# EAGLE design stm32-d40plus (EAGLE 6.4)

## Sheet 1 of 2
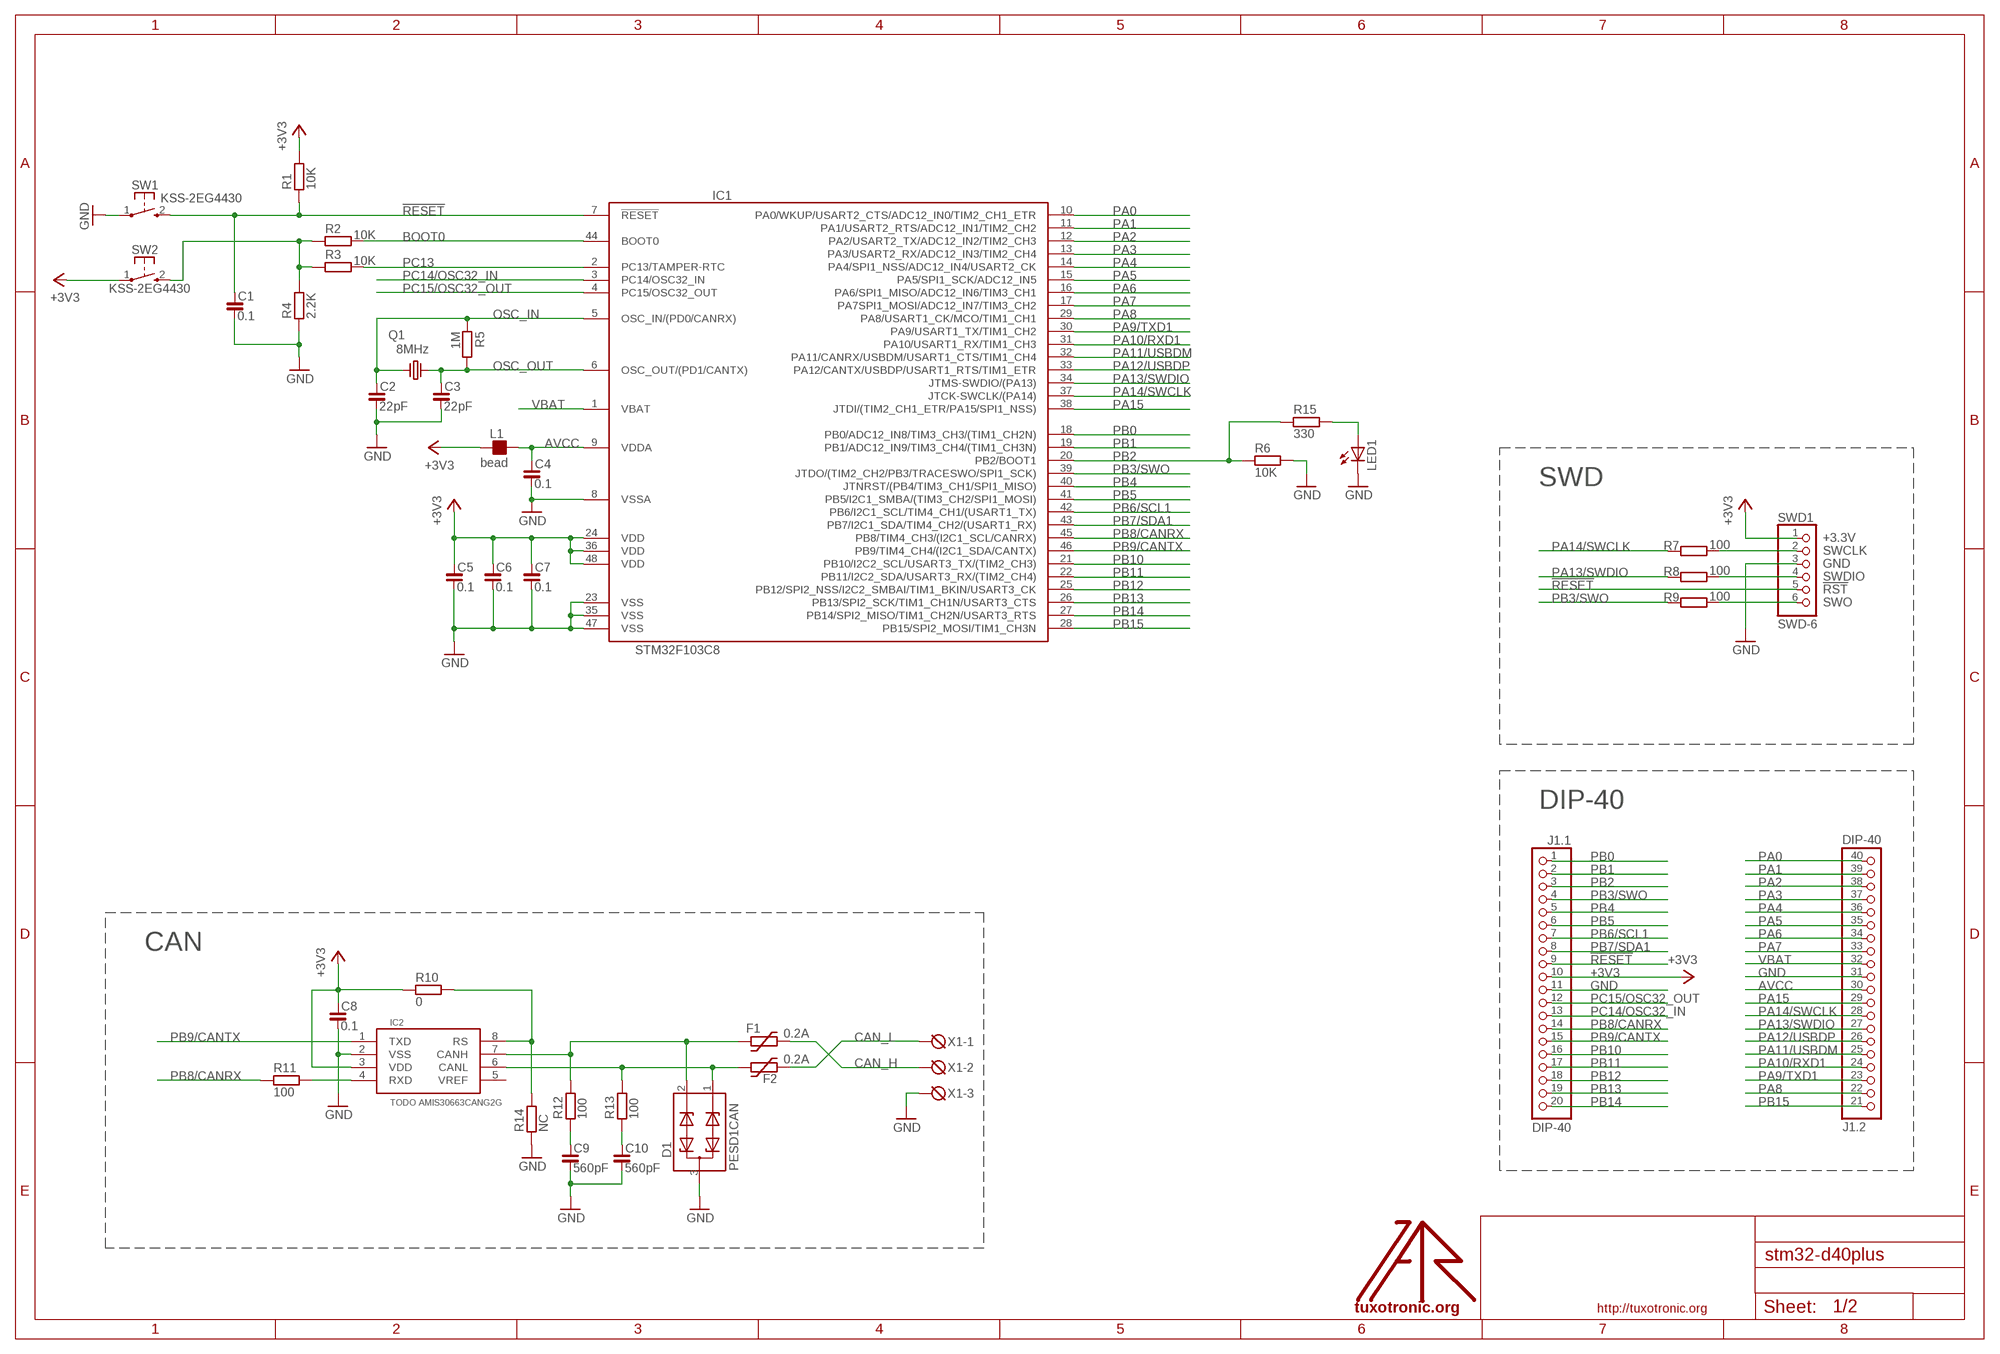
[diagram p0: schematic, sheet 1]

### Parts
C1  0.1  C_0603  [C0603]
C2  22pF  C_0603  [C0603]
C3  22pF  C_0603  [C0603]
C4  0.1  C_0603  [C0603]
C5  0.1  C_0603  [C0603]
C6  0.1  C_0603  [C0603]
C7  0.1  C_0603  [C0603]
C8  0.1  C_0603  [C0603]
C9  560pF  C_0603  [C0603]
C10  560pF  C_0603  [C0603]
D1  PESD1CAN  [SOT23]
F1  0.2A  1206L  [1206L]
F2  0.2A  1206L  [1206L]
IC1  STM32F103C8  [LQFP48]
IC2  TODO AMIS30663CANG2G  SN65HVD230  [SO08]
J1  DIP-40  [DIP-40]
L1  bead  FB_0603  [L0603]
LED1  LEDCHIPLED_0603  [CHIPLED_0603]
Q1  8MHz  CRYSTAL-HC49S  [HC49/S]
R1  10K  R_0603  [R0603]
R2  10K  R_0603  [R0603]
R3  10K  R_0603  [R0603]
R4  2.2K  R_0603  [R0603]
R5  1M  R_0603  [R0603]
R6  10K  R_0603  [R0603]
R7  100  R_0603  [R0603]
R8  100  R_0603  [R0603]
R9  100  R_0603  [R0603]
R10  0  R_0603  [R0603]
R11  100  R_0603  [R0603]
R12  100  R_0603  [R0603]
R13  100  R_0603  [R0603]
R14  NC  R_0603  [R0603]
R15  330  R_0603  [R0603]
SW1  KSS-2EG4430  [KSS-2EG4430]
SW2  KSS-2EG4430  [KSS-2EG4430]
SWD1  SWD-6  [JTAG6PIN]
U$  LOGO  [TT_LOGO]
X1  DG3XX-03-3.5  [DG350-3.5-03P]

### Nets
!RESET: C1.1 IC1.7(!RESET) J1.9 R1.1 SW1.2(S) SWD1.5
+3V3: C5.1 C6.1 C7.1 C8.1 IC1.24(VDD) IC1.36(VDD) IC1.48(VDD) IC2.3(VDD) J1.10 L1.1 R1.2 R10.1 SW2.1(P) SWD1.1
AVCC: C4.1 IC1.9(VDDA) J1.30 L1.2
BOOT0: IC1.44(BOOT0) R2.2
CAN_CTRL: IC2.8(RS) R10.2 R14.2
CAN_H: F1.P$2 X1.2
CAN_L: F2.P$2 X1.1
GND: C1.2 C2.2 C3.2 C4.2 C5.2 C6.2 C7.2 C8.2 C9.2 C10.2 D1.3 IC1.8(VSSA) IC1.23(VSS) IC1.35(VSS) IC1.47(VSS) IC2.2(VSS) J1.11 J1.31 LED1.C R4.1 R6.2 R14.1 SW1.1(P) SWD1.3 X1.3
N$1: R2.1 R3.1 R4.2 SW2.2(S)
N$2: R7.2 SWD1.2
N$3: R8.2 SWD1.4
N$4: R9.2 SWD1.6
N$5: LED1.A R15.2
N$7: IC2.4(RXD) R11.2
N$51: D1.2 F1.P$1 IC2.7(CANH) R12.2
N$52: D1.1 F2.P$1 IC2.6(CANL) R13.2
N$54: C10.1 R13.1
N$55: C9.1 R12.1
OSC_IN: C2.1 IC1.5(OSC_IN/(PD0/CANRX)) Q1.1 R5.1
OSC_OUT: C3.1 IC1.6(OSC_OUT/(PD1/CANTX)) Q1.2 R5.2
PA0: IC1.10(PA0/WKUP/USART2_CTS/ADC12_IN0/TIM2_CH1_ETR) J1.40
PA1: IC1.11(PA1/USART2_RTS/ADC12_IN1/TIM2_CH2) J1.39
PA2: IC1.12(PA2/USART2_TX/ADC12_IN2/TIM2_CH3) J1.38
PA3: IC1.13(PA3/USART2_RX/ADC12_IN3/TIM2_CH4) J1.37
PA4: IC1.14(PA4/SPI1_NSS/ADC12_IN4/USART2_CK) J1.36
PA5: IC1.15(PA5/SPI1_SCK/ADC12_IN5) J1.35
PA6: IC1.16(PA6/SPI1_MISO/ADC12_IN6/TIM3_CH1) J1.34
PA7: IC1.17(PA7SPI1_MOSI/ADC12_IN7/TIM3_CH2) J1.33
PA8: IC1.29(PA8/USART1_CK/MCO/TIM1_CH1) J1.22
PA9/TXD1: IC1.30(PA9/USART1_TX/TIM1_CH2) J1.23
PA10/RXD1: IC1.31(PA10/USART1_RX/TIM1_CH3) J1.24
PA11/USBDM: IC1.32(PA11/CANRX/USBDM/USART1_CTS/TIM1_CH4) J1.25
PA12/USBDP: IC1.33(PA12/CANTX/USBDP/USART1_RTS/TIM1_ETR) J1.26
PA13/SWDIO: IC1.34(JTMS-SWDIO/(PA13)) J1.27 R8.1
PA14/SWCLK: IC1.37(JTCK-SWCLK/(PA14)) J1.28 R7.1
PA15: IC1.38(JTDI/(TIM2_CH1_ETR/PA15/SPI1_NSS)) J1.29
PB0: IC1.18(PB0/ADC12_IN8/TIM3_CH3/(TIM1_CH2N)) J1.1
PB1: IC1.19(PB1/ADC12_IN9/TIM3_CH4/(TIM1_CH3N)) J1.2
PB2: IC1.20(PB2/BOOT1) J1.3 R6.1 R15.1
PB3/SWO: IC1.39(JTDO/(TIM2_CH2/PB3/TRACESWO/SPI1_SCK)) J1.4 R9.1
PB4: IC1.40(JTNRST/(PB4/TIM3_CH1/SPI1_MISO)) J1.5
PB5: IC1.41(PB5/I2C1_SMBA/(TIM3_CH2/SPI1_MOSI)) J1.6
PB6/SCL1: IC1.42(PB6/I2C1_SCL/TIM4_CH1/(USART1_TX)) J1.7
PB7/SDA1: IC1.43(PB7/I2C1_SDA/TIM4_CH2/(USART1_RX)) J1.8
PB8/CANRX: IC1.45(PB8/TIM4_CH3/(I2C1_SCL/CANRX)) J1.14 R11.1
PB9/CANTX: IC1.46(PB9/TIM4_CH4/(I2C1_SDA/CANTX)) IC2.1(TXD) J1.15
PB10: IC1.21(PB10/I2C2_SCL/USART3_TX/(TIM2_CH3)) J1.16
PB11: IC1.22(PB11/I2C2_SDA/USART3_RX/(TIM2_CH4)) J1.17
PB12: IC1.25(PB12/SPI2_NSS/I2C2_SMBAI/TIM1_BKIN/USART3_CK) J1.18
PB13: IC1.26(PB13/SPI2_SCK/TIM1_CH1N/USART3_CTS) J1.19
PB14: IC1.27(PB14/SPI2_MISO/TIM1_CH2N/USART3_RTS) J1.20
PB15: IC1.28(PB15/SPI2_MOSI/TIM1_CH3N) J1.21
PC13: IC1.2(PC13/TAMPER-RTC) R3.2
PC14/OSC32_IN: IC1.3(PC14/OSC32_IN) J1.13
PC15/OSC32_OUT: IC1.4(PC15/OSC32_OUT) J1.12
VBAT: IC1.1(VBAT) J1.32
Unconnected: IC2.5(VREF)

### Notes on the sheet
- SWD
- DIP-40
- CAN

## Sheet 2 of 2
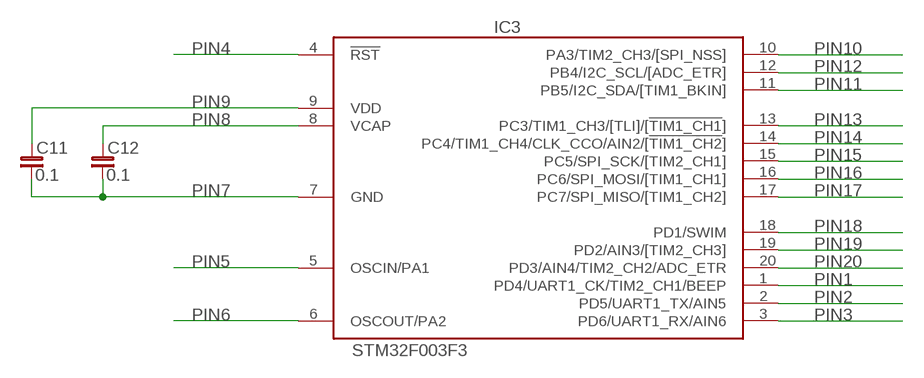
[diagram p1: schematic, sheet 2]

### Parts
C11  0.1  C_0805  [C0805]
C12  0.1  C_0805  [C0805]
IC3  STM32F003F3  [TSSOP20]

### Nets
PIN1: IC3.1(PD4/UART1_CK/TIM2_CH1/BEEP)
PIN2: IC3.2(PD5/UART1_TX/AIN5)
PIN3: IC3.3(PD6/UART1_RX/AIN6)
PIN4: IC3.4(!RST)
PIN5: IC3.5(OSCIN/PA1)
PIN6: IC3.6(OSCOUT/PA2)
PIN7: C11.2 C12.2 IC3.7(GND)
PIN8: C12.1 IC3.8(VCAP)
PIN9: C11.1 IC3.9(VDD)
PIN10: IC3.10(PA3/TIM2_CH3/[SPI_NSS])
PIN11: IC3.11(PB5/I2C_SDA/[TIM1_BKIN])
PIN12: IC3.12(PB4/I2C_SCL/[ADC_ETR])
PIN13: IC3.13(PC3/TIM1_CH3/[TLI]/[!TIM1_CH1!])
PIN14: IC3.14(PC4/TIM1_CH4/CLK_CCO/AIN2/[!TIM1_CH2!])
PIN15: IC3.15(PC5/SPI_SCK/[TIM2_CH1])
PIN16: IC3.16(PC6/SPI_MOSI/[TIM1_CH1])
PIN17: IC3.17(PC7/SPI_MISO/[TIM1_CH2])
PIN18: IC3.18(PD1/SWIM)
PIN19: IC3.19(PD2/AIN3/[TIM2_CH3])
PIN20: IC3.20(PD3/AIN4/TIM2_CH2/ADC_ETR)

## Library data of the parts
C1-C12 = rc-master-smd:C_: NON-POLARIZED CAP
D1 = protect:PESD1CAN: Features Due to the integrated diode structure only one small SOT23 package is needed to protect two CAN bus lines Max. peak pulse power: PPP = 200 W at tp = 8/20 ?s Low clamping voltage: VCL = 40 V at IPP = 1 A Ultra low leakage current: IRM < 1 nA ESD protection up to 23 kV IEC 61000-4-2, level 4 (ESD) IEC 61000-4-5 (surge); IPP = 3 A at tp = 8/20 ?s Small SMD plastic package Applications CAN bus protection Automotive applications
F1 F2 = ptc-littlefuse:1206L
IC1 = stm32:STM32F103C
IC2 = interfaces:SN65HVD230: CAN PHY driver
IC3 = stm8:STM32F003: Value line, 16 MHz STM8S 8-bit MCU, 8 Kbytes Flash, 128 bytes data EEPROM, 10-bit ADC, 3 timers, UART, SPI, I2C
J1 = stamp:DIP-40
L1 = rc-master-smd:FB_: FERRITE BEAD
LED1 = led:LED: LED OSRAM: - CHIPLED LG R971, LG N971, LY N971, LG Q971, LY Q971, LO R971, LY R971 LH N974, LH R974 LS Q976, LO Q976, LY Q976 LO Q996 - Hyper CHIPLED LW Q18S LB Q993, LB Q99A, LB R99A - SideLED LS A670, LO A670, LY A670, LG A670, LP A670 LB A673, LV A673, LT A673, LW A673 LH A674 LY A675 LS A676, LA A676, LO A676, LY A676, LW A676 LS A679, LY A679, LG A679 - Hyper Micro SIDELED® LS Y876, LA Y876, LO Y876, LY Y876 LT Y87S - SmartLED LW L88C, LW L88S LB L89C, LB L89S, LG L890 LS L89K, LO L89K, LY L89K LS L896, LA L896, LO L896, LY L896 - TOPLED LS T670, LO T670, LY T670, LG T670, LP T670 LSG T670, LSP T670, LSY T670, LOP T670, LYG T670 LG T671, LOG T671, LSG T671 LB T673, LV T673, LT T673, LW T673 LH T674 LS T676, LA T676, LO T676, LY T676, LB T676, LH T676, LSB T676, LW T676 LB T67C, LV T67C, LT T67C, LS T67K, LO T67K, LY T67K, LW E67C LS E67B, LA E67B, LO E67B, LY E67B, LB E67C, LV E67C, LT E67C LW T67C LS T679, LY T679, LG T679 LS T770, LO T770, LY T770, LG T770, LP T770 LB T773, LV T773, LT T773, LW T773 LH T774 LS E675, LA E675, LY E675, LS T675 LS T776, LA T776, LO T776, LY T776, LB T776 LHGB T686 LT T68C, LB T68C - Hyper Mini TOPLED® LB M676 - Mini TOPLED Santana® LG M470 LS M47K, LO M47K, LY M47K Source: http://www.osram.convergy.de - LUMILED® LXK2-PW12-R00, LXK2-PW12-S00, LXK2-PW14-U00, LXK2-PW14-V00 LXK2-PM12-R00, LXK2-PM12-S00, LXK2-PM14-U00 LXK2-PE12-Q00, LXK2-PE12-R00, LXK2-PE12-S00, LXK2-PE14-T00, LXK2-PE14-U00 LXK2-PB12-K00, LXK2-PB12-L00, LXK2-PB12-M00, LXK2-PB14-N00, LXK2-PB14-P00, LXK2-PB14-Q00 LXK2-PR12-L00, LXK2-PR12-M00, LXK2-PR14-Q00, LXK2-PR14-R00 LXK2-PD12-Q00, LXK2-PD12-R00, LXK2-PD12-S00 LXK2-PH12-R00, LXK2-PH12-S00 LXK2-PL12-P00, LXK2-PL12-Q00, LXK2-PL12-R00 Source: www.luxeon.com
Q1 = discrete:CRYSTAL-: CRYSTAL
R1-R15 = rc-master-smd:R_: RESISTOR
SW1 SW2 = buttons:KSS-2EG4430: Size: 3x6mm Height: 5mm from PCB Rating: DC12v 50mA Travel: 0.25±0.10mm Operating Force: 180±50gf Return Force: 60gf min Contact resistance: 100m? max Insulation resistance: 100M? min Operating life?50,000 cycles
SWD1 = jtag:SWD-6: STM32Fx Discovery
U$ = logo:LOGO
X1 = degson:DG3XX-03: DG350-3.5-03P DG306-5.0-03P

## Board
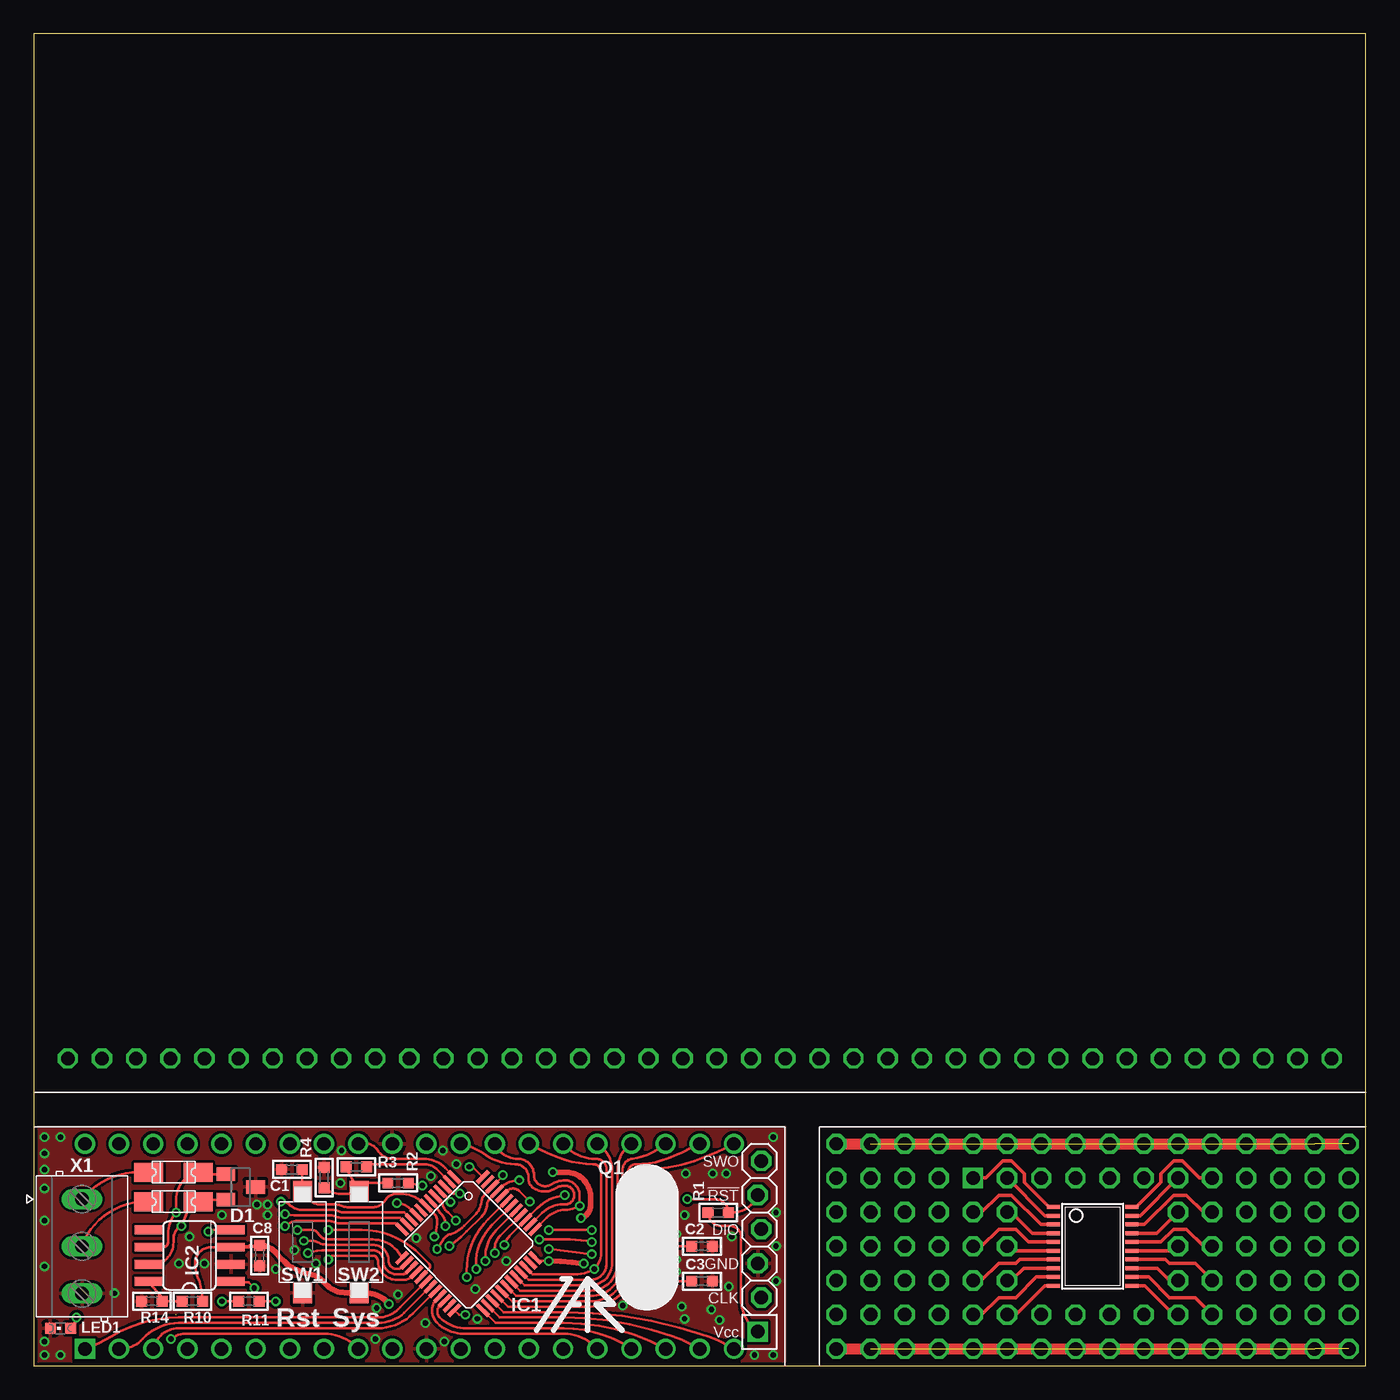
[diagram p2: board, top side]
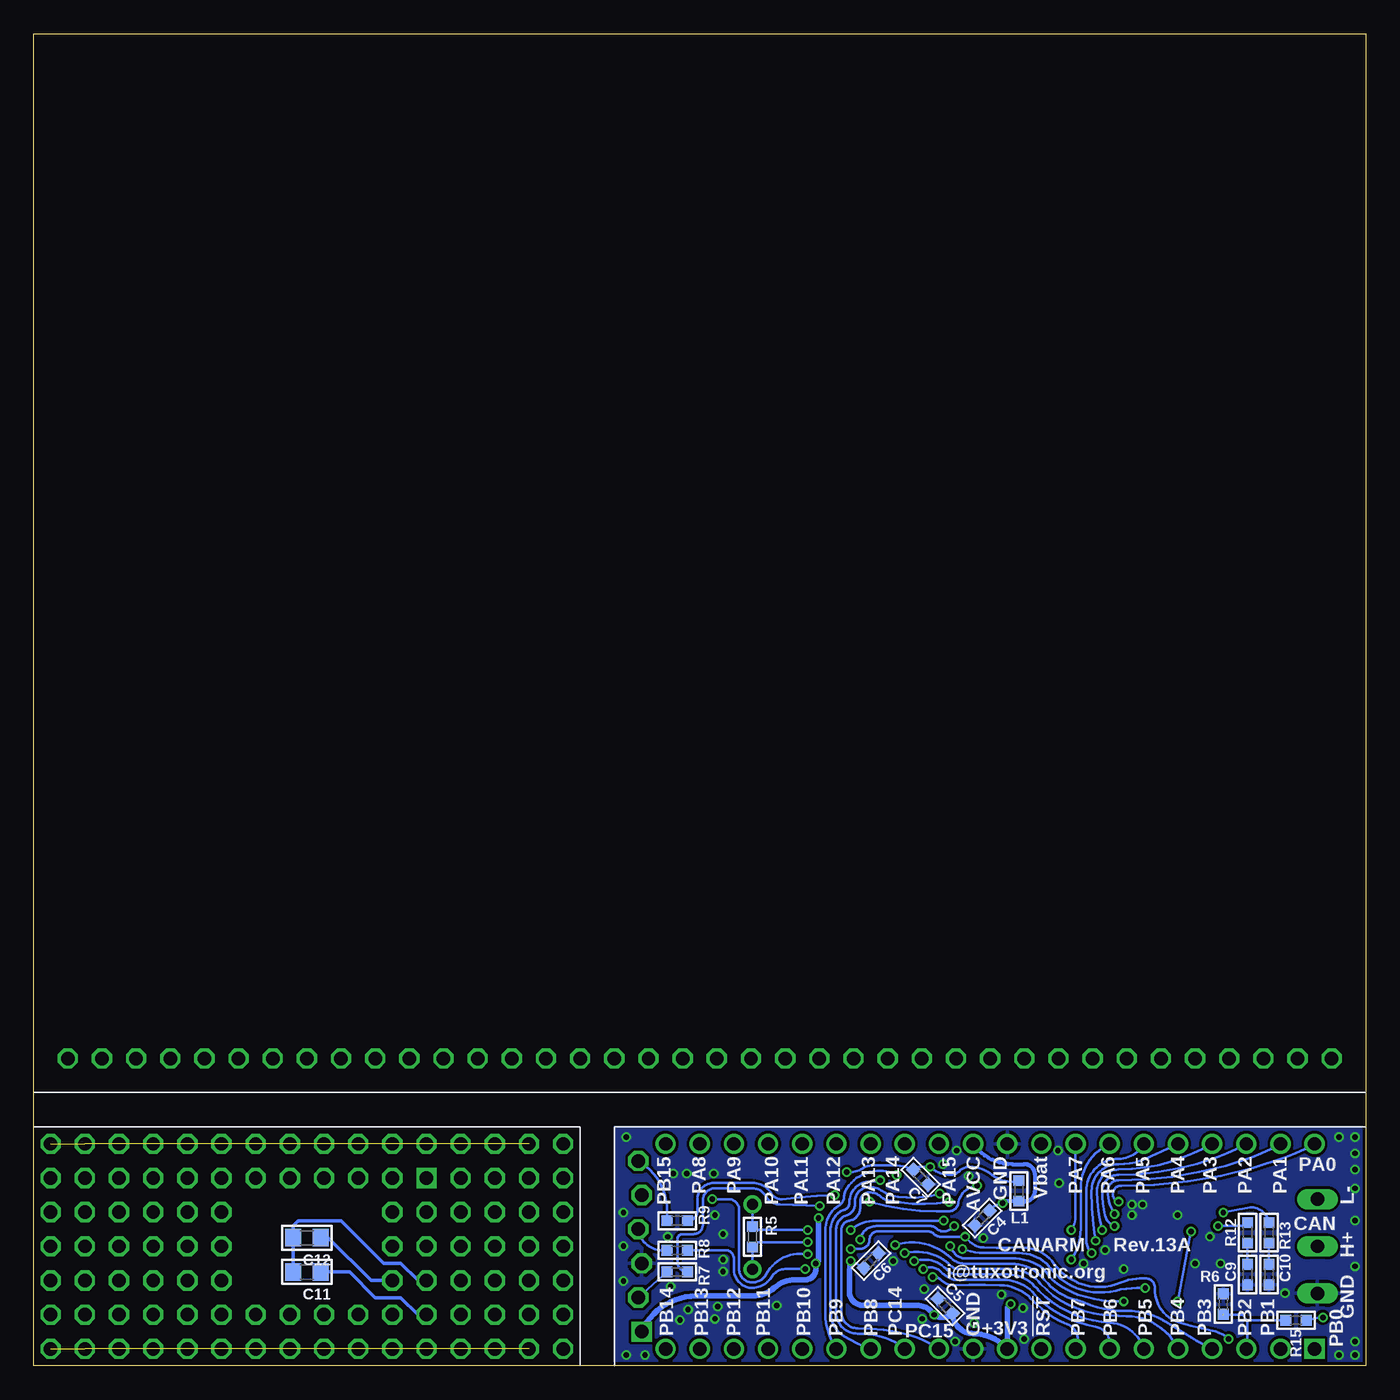
[diagram p3: board, bottom side, seen from below]

Size 99.06 x 99.06 mm. Coordinates in mm from the lower left corner, seen from the top.
Outline: 0,0 99.06,0 99.06,99.06 0,99.06 0,0
Copper layers (1*16): Top 0.035mm / dielectric 1.5mm / Bottom 0.035mm
Design rules "ITEADstudio_DRC": minimum track width 6mil, minimum drill 12mil, track to track 6mil, track to pad 6mil, pad to pad 6mil, via to via 6mil, smd to smd 0mil, copper to edge 10mil, drill to drill 10mil, minimum pad ring 10mil, minimum via ring 6mil, stop-mask expansion 2mil, vias tented up to drill 100mil, thermal gap 10mil

### Footprints (pad centres in the part's own frame; a part is rotated, then mirrored left to right if it is on the bottom)
C0603 = smd 0.8 x 0.8: 1 -0.762,0; 2 0.762,0
C0805 = smd 1.2 x 1.3: 1 -1.016,0; 2 1.016,0
SOT23 = smd 1 x 1.4: 1 -0.95,-1.1; 2 0.95,-1.1; 3 0,1.1
1206L = smd 2.16 x 1.4: P$1 -1.85,0; P$2 1.85,0
LQFP48 = smd 0.3 x 1.2: 1 -2.75,-4.25; 2 -2.25,-4.25; 3 -1.75,-4.25; 4 -1.25,-4.25; 5 -0.75,-4.25; 6 -0.25,-4.25; 7 0.25,-4.25; 8 0.75,-4.25; 9 1.25,-4.25; 10 1.75,-4.25; 11 2.25,-4.25; 12 2.75,-4.25; 25 2.75,4.25; 26 2.25,4.25; 27 1.75,4.25; 28 1.25,4.25; 29 0.75,4.25; 30 0.25,4.25; 31 -0.25,4.25; 32 -0.75,4.25; 33 -1.25,4.25; 34 -1.75,4.25; 35 -2.25,4.25; 36 -2.75,4.25 | smd 1.2 x 0.3: 13 4.25,-2.75; 14 4.25,-2.25; 15 4.25,-1.75; 16 4.25,-1.25; 17 4.25,-0.75; 18 4.25,-0.25; 19 4.25,0.25; 20 4.25,0.75; 21 4.25,1.25; 22 4.25,1.75; 23 4.25,2.25; 24 4.25,2.75; 37 -4.25,2.75; 38 -4.25,2.25; 39 -4.25,1.75; 40 -4.25,1.25; 41 -4.25,0.75; 42 -4.25,0.25; 43 -4.25,-0.25; 44 -4.25,-0.75; 45 -4.25,-1.25; 46 -4.25,-1.75; 47 -4.25,-2.25; 48 -4.25,-2.75
SO08 = smd 0.66 x 2.032: 1 -1.905,-3.073; 2 -0.635,-3.073; 3 0.635,-3.073; 4 1.905,-3.073; 5 1.905,3.073; 6 0.635,3.073; 7 -0.635,3.073; 8 -1.905,3.073
TSSOP20 = smd 0.305 x 0.991: 1 -2.925,-2.918; 2 -2.275,-2.918; 3 -1.625,-2.918; 4 -0.975,-2.918; 5 -0.325,-2.918; 6 0.325,-2.918; 7 0.975,-2.918; 8 1.625,-2.918; 9 2.275,-2.918; 10 2.925,-2.918; 11 2.925,2.918; 12 2.275,2.918; 13 1.625,2.918; 14 0.975,2.918; 15 0.325,2.918; 16 -0.325,2.918; 17 -0.975,2.918; 18 -1.625,2.918; 19 -2.275,2.918; 20 -2.925,2.918
DIP-40 = drill 1 square: 1 -24.13,-7.62 | drill 1: 2 -21.59,-7.62; 3 -19.05,-7.62; 4 -16.51,-7.62; 5 -13.97,-7.62; 6 -11.43,-7.62; 7 -8.89,-7.62; 8 -6.35,-7.62; 9 -3.81,-7.62; 10 -1.27,-7.62; 11 1.27,-7.62; 12 3.81,-7.62; 13 6.35,-7.62; 14 8.89,-7.62; 15 11.43,-7.62; 16 13.97,-7.62; 17 16.51,-7.62; 18 19.05,-7.62; 19 21.59,-7.62; 20 24.13,-7.62; 21 24.13,7.62; 22 21.59,7.62; 23 19.05,7.62; 24 16.51,7.62; 25 13.97,7.62; 26 11.43,7.62; 27 8.89,7.62; 28 6.35,7.62; 29 3.81,7.62; 30 1.27,7.62; 31 -1.27,7.62; 32 -3.81,7.62; 33 -6.35,7.62; 34 -8.89,7.62; 35 -11.43,7.62; 36 -13.97,7.62; 37 -16.51,7.62; 38 -19.05,7.62; 39 -21.59,7.62; 40 -24.13,7.62
L0603 = smd 0.8 x 0.8: 1 -0.762,0; 2 0.762,0
CHIPLED_0603 = smd 0.8 x 0.8: A 0,-0.75; C 0,0.75
HC49/S = drill 0.813: 1 -2.413,0; 2 2.413,0
R0603 = smd 0.8 x 0.8: 1 -0.762,0; 2 0.762,0
KSS-2EG4430 = smd 1.6 x 1.4: 1 -3.75,0; 2 3.75,0
JTAG6PIN = drill 1 square: 1 -6.35,0.127 | drill 1 octagon: 2 -3.81,-0.127; 3 -1.27,0.127; 4 1.27,-0.127; 5 3.81,0.127; 6 6.35,-0.127
DG350-3.5-03P = drill 1 long: 1 -3.5,0; 2 0,0; 3 3.5,0

### Placement (x,y rotation side)
C1  19.2,14.6 180 top
C2  49.7,8.9 0 top
C3  49.7,6.3 0 top
C4  28.53,10.99 225 bottom
C5  31.27,4.45 135 bottom
C6  36.78,7.82 45 bottom
C7  33.11,14.04 315 bottom
C8  16.8,8.2 270 top
C9  8.8,6.8 270 bottom
C10  7.2,6.8 270 bottom
C11  78.74,6.99 180 bottom
C12  78.74,9.53 180 bottom
D1  15.4,13.3 270 top
F1  10.4,12.2 180 top
F2  10.4,14.4 180 top
IC1  32.34,9.09 225 top
IC2  11.6,8.2 90 top
IC3  78.74,8.89 270 top
J1  27.94,8.89 0 top
L1  25.8,13.01 270 bottom
LED1  2,2.8 90 top
Q1  45.6,9.6 270 top
R1  50.9,11.4 180 top
R2  27.1,13.6 0 top
R3  24,14.8 0 top
R4  21.6,14 270 top
R5  45.6,9.6 270 bottom
R6  10.6,4.6 90 bottom
R7  51.2,7 180 bottom
R8  51.2,8.6 180 bottom
R9  51.2,10.8 180 bottom
R10  11.8,4.8 180 top
R11  16,4.8 180 top
R12  8.8,9.9 90 bottom
R13  7.2,9.9 90 bottom
R14  8.8,4.8 0 top
R15  5.2,3.4 0 bottom
SW1  20,9.2 90 top
SW2  24.2,9.2 90 top
SWD1  53.98,8.89 90 top
U$  41.2,5.2 0 top
X1  3.6,8.89 270 top

### Tracks (layer width: path | path; a pad name or v marks a point on that pad's centre or on a via)
!RESET  (via drill 0.4)
  Top 0.2: C1.1 SW1.2 arc68 21.4,12 22.4,12 arc-23 22.9,11.9 arc23 23.4,11.8 25.2,11.8 arc62 26.2,12.4 arc-53 27,12.8 27.28,12.8 arc-50 IC1.7 29.8,11.28 arc-46 30,10.8 arc-19 v29.8,9.6 | v38.3,8.7 v41.5,8.3 | v10.2,2 arc-37 11.4,2.4 21.6,2.4 arc-48 J1.9 | v48.6,12.4 50.66,12.4 arc-90 R1.1 51.95,11.4 arc69 SWD1.5
  Bottom 0.2: v38.3,8.7 37.6,8.7 arc-90 36.9,9.4 arc90 36.3,10 32.6,10 arc44 32.1,9.8 arc-44 31.6,9.6 v29.8,9.6 29.4,9.2 arc-41 28.4,8.8 arc-2 25.6,8.8 arc56 23.2,7.6 arc-77 18.2,6.2 arc26 16.5,6.5 arc-6 16.4,6.5 arc96 15.7,5.8 15.7,5.7 arc-74 13.8,3.2 arc-3 11.4,2.6 arc32 v10.2,2 | v41.5,8.3 arc-72 44.6,6.8 arc62 45.6,6.2 arc90 46.6,7.2 46.6,11.6 arc-90 47.4,12.4 v48.6,12.4
+3V3  (via drill 0.4)
  Top 0.2: IC1.24 31.62,3.8 v32.1,3.8 | IC1.48 32.7,14.74 v32.4,14.8 | v38.3,7.8 37.52,7.8 IC1.36 | IC2.3 13.23,8.84 arc90 12,7.6 arc23 12.2,6.6 arc-22 R10.1 | SWD1.1 arc-54 52.6,4.99 52.6,9.6 arc90 51.8,10.4 51.14,10.4 arc-90 R1.2
  Top 0.3: IC2.3 arc7 C8.1
  Top 0.406: v38.3,7.8 arc-9 v40.9,7.6 | v38.6,14.4 39.6,14.4 arc-90 41.4,12.6 41.4,11.9 arc-76 v40.7,11 | C8.1 arc-56 18.1,8.3 arc41 20.6,6.8 arc-41 21.6,6.2 arc52 23.15,5.45 SW2.1 24.25,5.4 24.8,5.4 arc-53 v26.4,4.6
  Bottom 0.2: C6.1 38.24,7.8 v38.3,7.8 | C5.1 30.84,3.8 | v38.6,14.4 38.4,14.4 arc-33 37.4,14.7 arc30 36.8,14.9 arc7 34.9,14.9 arc22 C7.1 33.42,14.8 v32.4,14.8 arc-44 30.9,14.2 arc-46 30.2,14.5 arc46 29.5,14.8 arc39 27.8,14.2 arc-54 L1.1
  Bottom 0.4: 30.84,3.8 arc71 v32.1,3.8
  Bottom 0.406: v38.3,7.8 arc-10 38.4,6.7 38.4,5.5 arc-90 37.4,4.5 33.4,4.5 arc57 v32.1,3.8 | v40.7,11 40.7,7.8 v40.9,7.6 arc15 40.9,7.1 arc82 41.7,6.4 42.4,6.4 arc-41 44,5.8 arc41 45.6,5.2 49.79,5.2 arc-66 SWD1.1 | C5.1 arc-89 29.2,2.4 arc48 J1.10 26.67,4.33 v26.4,4.6
AVCC  (via drill 0.4)
  Top 0.2: IC1.9 27.96,11.7 arc45 v27,12.1
  Bottom 0.2: C4.1 27.82,11.7 arc38 v27,12.1
  Bottom 0.3: v27,12.1 26.85,12.25 L1.2 25.35,12.25 arc-90 24.6,13 24.6,14.2 arc-90 25.4,15 26.3,15 arc55 J1.30
BOOT0  (via drill 0.4)
  Top 0.2: v28.9,13.4 R2.2 | v36.9,12.2 36.1,13 arc90 35.19,13 IC1.44
  Bottom 0.2: v28.9,13.4 arc-69 30.3,12.2 arc90 31,11.5 31.9,11.5 arc16 v36.9,12.2
CAN_CTRL
  Top 0.2: IC2.8 9.56,5.06 R14.2 R10.2
CAN_H
  Top 0.2: F1.P$2 8.31,12.2 arc70 X1.2
CAN_L
  Top 0.2: F2.P$2 7.8,14.4 arc51 X1.1
GND  (via drill 0.4)
  other vias: 28.44,9.5 32.84,5.7 35.14,7.8 22.8,13.6 30.44,16 12.7,7.6 48.5,14.3 48.4,11.2 51.7,5.9 43.8,4.5 17.4,12 17.4,11.2 16.6,12 11.6,9.6 6,5.4 29.14,3.2 30.54,1.8 48.2,4.4 48.4,3.5 50.4,4.2 47.8,7 47.8,7.9 47.8,9.8 50.5,14.3 51.5,14.3 31.44,15 29.54,14.1 22.9,16 19.4,8.6 18,7.2 33,3.5 25.5,4.3 27.1,5.3 25.4,2 51.9,9.6 55.2,11.4 55.2,8.9 55.2,6.3 53.6,0.8 51,3.4 0.8,0.8 2,0.8 0.8,17 2,17 0.8,15.8 21,7.6 55,0.8 55,17 14,11.2 10.8,7.6 0.8,14.6 0.8,13.2 0.8,10.8 0.8,7.4 0.8,1.8
  pour Top (isolate 0.203): -1.27,17.78 55.88,17.78 55.88,-1.27 -1.27,-1.27
  pour Bottom (isolate 0.203): -2.54,17.78 55.88,17.78 55.88,-2.54 -2.54,-2.54
N$1
  Top 0.2: R3.1 23.24,14.71 SW2.2 | R2.1 24.65,13.6 SW2.2 | SW2.2 24.45,12.8 22.8,12.8 arc-40 R4.2
N$2
  Bottom 0.2: R7.2 SWD1.2
N$3
  Bottom 0.2: R8.2 52.34,8.6 arc83 SWD1.4
N$4
  Bottom 0.2: R9.2 51.96,11.56 arc-60 SWD1.6
N$5  (via drill 0.4)
  Top 0.2: v3.2,3.6 3,3.05 LED1.A
  Bottom 0.2: R15.2 3.4,3.6 v3.2,3.6
N$6  (via drill 1)
  other vias: 2.54,22.86
N$7  (via drill 0.4)
  Top 0.2: R11.2 v14,4.8 | v13,10 13.11,10.11 IC2.4
  Bottom 0.2: v14,4.8 v13,10
N$8  (via drill 1)
  other vias: 5.08,22.86
N$9  (via drill 1)
  other vias: 7.62,22.86
N$10  (via drill 1)
  other vias: 10.16,22.86
N$11  (via drill 1)
  other vias: 12.7,22.86
N$12  (via drill 1)
  other vias: 15.24,22.86
N$13  (via drill 1)
  other vias: 17.78,22.86
N$14  (via drill 1)
  other vias: 20.32,22.86
N$15  (via drill 1)
  other vias: 22.86,22.86
N$16  (via drill 1)
  other vias: 25.4,22.86
N$17  (via drill 1)
  other vias: 27.94,22.86
N$18  (via drill 1)
  other vias: 30.48,22.86
N$19  (via drill 1)
  other vias: 33.02,22.86
N$20  (via drill 1)
  other vias: 35.56,22.86
N$21  (via drill 1)
  other vias: 38.1,22.86
N$22  (via drill 1)
  other vias: 40.64,22.86
N$23  (via drill 1)
  other vias: 43.18,22.86
N$24  (via drill 1)
  other vias: 45.72,22.86
N$25  (via drill 1)
  other vias: 48.26,22.86
N$26  (via drill 1)
  other vias: 50.8,22.86
N$27  (via drill 1)
  other vias: 53.34,22.86
N$28  (via drill 1)
  other vias: 55.88,22.86
N$29  (via drill 1)
  other vias: 58.42,22.86
N$30  (via drill 1)
  other vias: 60.96,22.86
N$31  (via drill 1)
  other vias: 63.5,22.86
N$32  (via drill 1)
  other vias: 66.04,22.86
N$33  (via drill 1)
  other vias: 68.58,22.86
N$34  (via drill 1)
  other vias: 71.12,22.86
N$35  (via drill 1)
  other vias: 73.66,22.86
N$36  (via drill 1)
  other vias: 76.2,22.86
N$37  (via drill 1)
  other vias: 78.74,22.86
N$38  (via drill 1)
  other vias: 81.28,22.86
N$39  (via drill 1)
  other vias: 83.82,22.86
N$40  (via drill 1)
  other vias: 86.36,22.86
N$41  (via drill 1)
  other vias: 88.9,22.86
N$42  (via drill 1)
  other vias: 91.44,22.86
N$43  (via drill 1)
  other vias: 93.98,22.86
N$44  (via drill 1)
  other vias: 96.52,22.86
N$45  (via drill 1)
  other vias: 59.69,13.97
N$46  (via drill 1)
  other vias: 62.23,13.97
N$47  (via drill 1)
  other vias: 64.77,13.97
N$48  (via drill 1)
  other vias: 67.31,13.97
N$51  (via drill 0.4)
  Top 0.2: D1.2 12.4,12.35 F1.P$1 11.7,12.2 v11,10.4 arc67 10.4,9.4 10.4,9.2 arc-65 9.37,7.57 IC2.7
  Bottom 0.2: v11,10.4 8.94,10.4 R12.2
N$52  (via drill 0.4)
  Top 0.2: D1.1 12.4,14.25 F2.P$1 | IC2.6 9.63,8.84 arc90 10,9.2 10,9.8 arc-41 v10.6,11.4 10.6,12.4 arc-79 F2.P$1 | 12,14.4 F2.P$1
  Bottom 0.2: v10.6,11.4 8.6,11.8 arc78 R13.2
N$53  (via drill 1)
  other vias: 74.93,13.97
N$54
  Bottom 0.2: C10.1 R13.1
N$55
  Bottom 0.2: C9.1 R12.1
N$56  (via drill 1)
  other vias: 77.47,13.97
N$57  (via drill 1)
  other vias: 80.01,13.97
N$58  (via drill 1)
  other vias: 82.55,13.97
N$61  (via drill 1)
  other vias: 90.17,13.97
N$62  (via drill 1)
  other vias: 92.71,13.97
N$63  (via drill 1)
  other vias: 95.25,13.97
N$64  (via drill 1)
  other vias: 95.25,11.43
N$65  (via drill 1)
  other vias: 95.25,8.89
N$66  (via drill 1)
  other vias: 95.25,6.35
N$67  (via drill 1)
  other vias: 95.25,3.81
N$83  (via drill 1)
  other vias: 59.69,3.81
N$84  (via drill 1)
  other vias: 59.69,6.35
N$85  (via drill 1)
  other vias: 59.69,8.89
N$86  (via drill 1)
  other vias: 59.69,11.43
N$87  (via drill 1)
  other vias: 62.23,11.43
N$88  (via drill 1)
  other vias: 64.77,11.43
N$89  (via drill 1)
  other vias: 67.31,11.43
N$98  (via drill 1)
  other vias: 90.17,11.43
N$99  (via drill 1)
  other vias: 92.71,11.43
N$100  (via drill 1)
  other vias: 92.71,8.89
N$101  (via drill 1)
  other vias: 92.71,6.35
N$102  (via drill 1)
  other vias: 92.71,3.81
N$103  (via drill 1)
  other vias: 90.17,3.81
N$104  (via drill 1)
  other vias: 90.17,6.35
N$105  (via drill 1)
  other vias: 90.17,8.89
N$114  (via drill 1)
  other vias: 82.55,3.81
N$115  (via drill 1)
  other vias: 80.01,3.81
N$120  (via drill 1)
  other vias: 77.47,3.81
N$121  (via drill 1)
  other vias: 74.93,3.81
N$130  (via drill 1)
  other vias: 67.31,8.89
N$131  (via drill 1)
  other vias: 67.31,6.35
N$132  (via drill 1)
  other vias: 67.31,3.81
N$133  (via drill 1)
  other vias: 64.77,3.81
N$134  (via drill 1)
  other vias: 64.77,6.35
N$135  (via drill 1)
  other vias: 64.77,8.89
N$136  (via drill 1)
  other vias: 62.23,8.89
N$137  (via drill 1)
  other vias: 62.23,6.35
N$138  (via drill 1)
  other vias: 62.23,3.81
N$155  (via drill 1)
  other vias: 97.79,13.97
N$156  (via drill 1)
  other vias: 97.79,11.43
N$157  (via drill 1)
  other vias: 97.79,8.89
N$158  (via drill 1)
  other vias: 97.79,6.35
N$159  (via drill 1)
  other vias: 97.79,3.81
OSC_IN  (via drill 0.4)
  Top 0.2: v31.4,10.8 30.8,11.4 arc-23 30.4,12 arc36 IC1.5 | v38.3,10.1 v41.5,10.1 | C2.1 47.06,8.9 arc-90 R5.1 Q1.1
  Bottom 0.2: v31.4,10.8 36.4,10.8 arc-40 v38.3,10.1 | Q1.1 R5.1 45.34,10.1 v41.5,10.1
OSC_OUT  (via drill 0.4)
  Top 0.2: v37.6,9.4 39.9,9.4 arc-14 v41.5,9.2 | v30.6,10.4 arc53 30.3,11.3 arc-16 30,11.7 arc24 IC1.6 | C3.1 47.49,6.3 arc-50 Q1.2
  Bottom 0.2: Q1.2 R5.2 45.24,9.2 v41.5,9.2 | v30.6,10.4 arc53 31.4,10 arc44 31.9,10.2 arc-44 32.4,10.4 36.4,10.4 arc-80 v37.6,9.4
PA0  (via drill 0.4)
  Top 0.2: IC1.10 27.55,11.4 23.2,11.4 arc-23 22.7,11.5 arc23 22.2,11.6 20,11.6 arc-44 19,12 arc50 v18.4,12.2
  Bottom 0.2: J1.40 arc8 6,15.5 arc21 18.2,13.4 arc-162 v18.4,12.2
PA1  (via drill 0.4)
  Top 0.2: IC1.11 27.25,11 23,11 arc-23 22.5,11.1 arc23 22,11.2 19.7,11.2 arc-11 v18.7,11.3
  Bottom 0.2: J1.39 arc11 8.5,15.5 arc19 18.4,13.8 arc-90 19.2,13 arc-33 v18.7,11.3
PA2  (via drill 0.4)
  Top 0.2: IC1.12 26.94,10.6 22.8,10.6 arc-23 22.3,10.7 arc23 21.8,10.8 19.8,10.8 arc40 v18.7,10.4
  Bottom 0.2: J1.38 arc9 11.1,15.5 arc20 18.4,14.2 arc-90 19.6,13 arc-13 19.4,11.2 arc-57 v18.7,10.4
PA3  (via drill 0.4)
  Top 0.2: v19.6,10.1 20.7,10.1 arc-57 21.2,9.8 arc59 21.9,9.4 25.2,9.4 arc-64 IC1.13
  Bottom 0.2: v19.6,10.1 arc16 20,13 arc90 18.4,14.6 arc-21 13.6,15.5 arc-7 J1.37
PA4  (via drill 0.4)
  Top 0.2: v20.1,9.3 20.7,9.3 arc-28 21.1,9.2 arc28 21.9,9 25.2,9 arc-90 26.4,7.8 arc90 27,7.2 arc65 IC1.14
  Bottom 0.2: v20.1,9.3 arc9 20.4,13 arc90 18.4,15 arc-27 15.9,15.6 arc3 J1.36
PA5  (via drill 0.4)
  Top 0.2: v20.4,8.4 arc-16 21.8,8.6 25.2,8.6 arc-90 26,7.8 arc90 27,6.8 27.38,6.8 arc50 27.8,7 arc-6 IC1.15
  Bottom 0.2: v20.4,8.4 arc44 20.8,9.4 20.8,13 arc90 18.4,15.4 arc-61 J1.35
PA6  (via drill 0.4)
  Top 0.2: v21.9,7.9 22.2,8.2 25.2,8.2 arc-90 25.6,7.8 arc90 27,6.4 27.48,6.4 arc61 IC1.16
  Bottom 0.2: J1.34 arc-66 21.2,13.2 21.2,10.2 arc34 v21.9,7.9
PA7  (via drill 0.4)
  Top 0.2: IC1.17 29.4,7.21 arc90 29.4,7.6 28.4,8.6 arc41 24.4,10.1 v21.9,10.1
  Bottom 0.2: J1.33 21.59,11.21 arc31 v21.9,10.1
PA8
  Top 0.2: IC1.29 35.57,4.8 41.4,4.8 arc90 44.2,7.6 44.2,14.4 arc-90 44.8,15 arc24 47.6,15.6 arc2 J1.22
PA9/TXD1
  Top 0.2: IC1.30 35.88,5.2 41.4,5.2 arc90 43.8,7.6 43.8,14.6 arc-82 44.5,15.4 arc33 J1.23
PA10/RXD1
  Top 0.2: IC1.31 36.18,5.6 41.4,5.6 arc90 43.4,7.6 43.4,14.6 arc-58 J1.24
PA11/USBDM
  Top 0.2: IC1.32 36.49,6 41.4,6 arc90 43,7.6 43,14.6 arc59 J1.25
PA12/USBDP
  Top 0.2: IC1.33 36.8,6.4 41.4,6.4 arc90 42.6,7.6 42.6,14.6 arc90 41.8,15.4 arc-49 J1.26
PA13/SWDIO  (via drill 0.4)
  Top 0.2: IC1.34 37.1,6.8 40.2,6.8 arc30 v41.7,7.2 arc42 42.2,8.5 42.2,14.4 arc90 41.6,15 arc-22 39,15.5 arc-6 J1.27
  Bottom 0.2: v41.7,7.2 arc-5 43.2,7.2 arc-57 44.2,6.6 arc59 45.6,5.8 arc90 47,7.2 47,8 arc-90 47.6,8.6 R8.1
PA14/SWCLK  (via drill 0.4)
  Top 0.2: IC1.37 38.14,11 arc-42 39.5,11.6 arc25 v40.6,11.9 40.6,12.7 arc90 39.5,13.8 arc33 38.5,13.5 arc-123 37.2,14.2 arc90 36,15.4 arc-66 J1.28
  Bottom 0.2: v40.6,11.9 arc-4 43.6,12 arc62 44.6,12.6 arc-62 45.6,13.2 48.4,13.2 arc-90 49.3,12.3 49.3,10.5 arc90 50,9.8 50.8,9.8 arc-90 51.2,9.4 51.2,7.76 arc-90 R7.1
PA15
  Top 0.2: IC1.38 37.8,11.37 arc-49 39.5,12 arc90 40.2,12.7 arc90 39.5,13.4 arc32 38.8,13.2 arc-64 37.2,13.2 arc-63 36.8,14 arc90 35.8,15 arc-35 33.6,15.7 arc23 J1.29
PB0
  Top 0.2: IC1.18 27.25,4.35 arc-49 25.6,3.6 10.8,3.6 arc31 5.8,2.2 arc-12 J1.1
PB1
  Top 0.2: IC1.19 27.55,3.95 arc-42 25.6,3.2 10.8,3.2 arc48 8.1,2 arc-51 J1.2
PB2  (1 unrouted)
  Top 0.2: IC1.20 28.2,3.9 arc-46 25.6,2.8 10.8,2.8 arc77 J1.3
  Bottom 0.2: R15.1 8.8,3.4 | 8.8,3.4 8.8,1.36 J1.3 | 10.6,3.8 9.2,3.8 8.8,3.4
PB3/SWO  (via drill 0.4)
  Top 0.2: v35,9 arc-29 35.4,9.68 IC1.39 37.42,11.7 arc-39 v39.5,12.7
  Bottom 0.2: v35,9 arc56 31.2,8.3 arc0 30.7,7.9 arc-41 29.8,7.6 26.4,7.6 arc51 23.9,6.4 arc-39 21.5,4.9 arc11 20.9,4.7 arc-25 18,4.1 arc36 14.4,3 arc-9 J1.4 | v39.5,12.7 arc-4 43.4,12.4 arc66 44.2,12.8 arc-59 45.6,13.6 48.5,13.6 arc-90 49.7,12.4 49.7,11.54 arc90 R9.1
PB4  (via drill 0.4)
  Top 0.2: IC1.40 34.7,9.68 arc55 v34.3,8.4
  Bottom 0.2: v34.3,8.4 arc58 30.8,7.4 arc-46 30.3,7.2 arc3 26.4,7.2 arc50 24.2,6.1 arc-41 19.6,3.8 arc-6 17.8,3.7 arc64 J1.5
PB5  (via drill 0.4)
  Top 0.2: IC1.41 34.4,10.09 arc51 v33.6,7.8
  Bottom 0.2: v33.6,7.8 arc62 31.2,7.2 arc-16 30.8,6.9 arc-29 30.4,6.8 arc1 26.6,6.8 arc41 24.8,6.1 arc1 24.3,5.6 arc-42 19,3.2 arc69 J1.6
PB6/SCL1  (via drill 0.4)
  Top 0.2: IC1.42 34.1,10.5 arc50 v32.9,7.2
  Bottom 0.2: v32.9,7.2 arc73 31.6,7 arc-19 30.9,6.5 arc-30 30.4,6.4 27,6.4 arc49 24.6,5.3 arc-17 23.2,4.1 arc-22 20.1,2.9 arc94 J1.7
PB7/SDA1  (via drill 0.4)
  Top 0.2: IC1.43 33.8,10.9 arc49 v32.2,6.6
  Bottom 0.2: v32.2,6.6 arc53 31.6,6.4 arc-46 30.6,6 arc3 27.2,6 arc44 24.9,5 arc-1 24.5,4.6 arc-23 22.2,3.1 arc99 J1.8
PB8/CANRX  (via drill 0.4)
  Top 0.2: v18,4.8 R11.1 | v36.1,13.8 arc41 34.78,13.3 IC1.45 34,12.52 arc38 33.7,11.9 arc-40 33.3,11.1 32.2,10 arc-10 v30.9,8.9
  Bottom 0.2: v30.9,8.9 arc-28 30.6,8.4 arc-54 29.8,8 arc1 29.1,8 arc-1 26.4,8 arc31 24.2,7.4 arc28 23.8,7 arc-18 23.3,6.4 arc-22 21.4,5.3 arc-19 18.4,4.8 v18,4.8 | J1.14 arc13 38.8,2.2 arc58 39.8,4 39.8,10.1 arc45 39.3,11.3 arc28 38.8,11.6 arc-78 38.4,12.2 arc90 36.9,13.7 36.8,13.7 arc-13 v36.1,13.8
PB9/CANTX  (via drill 0.4)
  Top 0.2: v16.4,5.8 16,6.2 14.77,6.2 IC2.1 | v34.9,14.2 34.77,14 IC1.46 33.6,12.82 arc39 33.3,12.2 arc-35 32.9,11.3 32,10.4 arc-28 31,9.8 arc46 30.4,9.3 arc-13 v30,8.7
  Bottom 0.2: J1.15 arc34 40.2,4 40.2,10.1 arc58 39.2,11.9 arc-53 38.8,12.6 arc30 38.6,13.2 arc58 36.1,14.5 arc25 v34.9,14.2 | v16.4,5.8 17,5.8 arc-14 18.6,5.6 arc51 22.6,6.4 arc16 23.4,7.2 arc-53 25.8,8.4 28.4,8.4 arc21 v30,8.7
PB10
  Top 0.2: IC1.21 29.8,4.78 arc76 30,3.2 arc46 32,2.4 39.4,2.4 arc-48 J1.16
PB11
  Top 0.2: IC1.22 30.2,4.47 arc90 30.2,3.6 arc46 32.2,2.8 39.4,2.8 arc-34 J1.17
PB12
  Top 0.2: IC1.25 34.34,3.2 39.4,3.2 arc-29 J1.18
PB13
  Top 0.2: IC1.26 34.65,3.6 39.4,3.6 arc-20 47.5,2.2 arc-10 J1.19
PB14
  Top 0.2: IC1.27 34.95,4 39.4,4 arc-19 50.1,2.2 arc-12 J1.20
PB15
  Top 0.2: IC1.28 35.26,4.4 41.4,4.4 arc90 44.6,7.6 44.6,14 arc-90 45.2,14.6 arc23 50.1,15.6 arc3 J1.21
PC13
  Top 0.2: R3.2 24.8,14.8 25,15 29,15 arc-40 29.96,14.66 IC1.2
PC14/OSC32_IN  (via drill 0.4)
  Top 0.2: IC1.3 30.91,13 arc22 31.2,12.8 arc10 v31.7,12.8
  Bottom 0.2: J1.13 arc-29 36.6,2.3 arc-10 37.8,2.4 arc90 39.4,4 39.4,10.1 arc72 38.6,11.2 arc-70 38,12 38,12.2 arc90 36.9,13.3 arc40 35.8,12.9 arc-27 35.4,12.7 arc-29 v31.7,12.8
PC15/OSC32_OUT  (via drill 0.4)
  Top 0.2: IC1.4 v31,12.2
  Bottom 0.2: J1.12 arc-19 34,2.3 arc-15 37.8,2.8 arc90 39,4 39,10.1 arc81 38.4,10.8 arc-85 37.6,11.8 37.6,12.2 arc90 36.9,12.9 arc41 36.1,12.6 arc-29 35.5,12.3 arc-21 v31,12.2
PIN1  (via drill 1)
  Top 0.254: IC3.1 75.5,11.81 73.66,13.65 73.66,14.29 72.71,15.24 72.07,15.24 70.8,13.97 v69.85,13.97
PIN2  (via drill 1)
  Top 0.254: IC3.2 75.19,11.16 v72.39,13.97
PIN3  (via drill 1)
  Top 0.254: IC3.3 74.89,10.52 72.71,12.7 71.75,12.7 70.48,11.43 v69.85,11.43
PIN4  (via drill 1)
  Top 0.254: IC3.4 74.27,9.87 72.71,11.43 v72.39,11.43
PIN5  (via drill 1)
  Top 0.254: IC3.5 73.97,9.21 73.03,10.16 71.75,10.16 70.48,8.89 v69.85,8.89
PIN6  (via drill 1)
  Top 0.254: IC3.6 72.72,8.56 v72.39,8.89
PIN7  (via drill 1)
  Top 0.254: IC3.7 73.32,7.92 73.03,7.62 71.75,7.62 70.48,6.35 v69.85,6.35
  Bottom 0.254: v69.85,6.35 70.48,6.35 71.75,7.62 73.03,7.62 76.2,10.79 79.38,10.79 79.76,10.41 C12.2 C11.2
PIN8  (via drill 1)
  Top 0.254: IC3.8 73.62,7.26 72.71,6.35 v72.39,6.35
  Bottom 0.254: C12.1 77.15,9.53 73.98,6.35 v72.39,6.35
PIN9  (via drill 1)
  Top 0.254: IC3.9 74.56,6.62 73.03,5.08 71.75,5.08 70.48,3.81 v69.85,3.81
  Bottom 0.254: C11.1 75.56,6.99 73.66,5.08 71.75,5.08 70.48,3.81 v69.85,3.81
PIN10  (via drill 1)
  Top 0.254: IC3.10 75.18,5.96 73.03,3.81 v72.39,3.81
PIN11  (via drill 1)
  Top 0.254: IC3.11 82.62,5.96 84.77,3.81 v85.09,3.81
PIN12  (via drill 1)
  Top 0.254: IC3.12 82.92,6.62 84.45,5.08 86.36,5.08 v87.63,3.81
PIN13  (via drill 1)
  Top 0.254: IC3.13 83.54,7.26 84.45,6.35 v85.09,6.35
PIN14  (via drill 1)
  Top 0.254: IC3.14 84.16,7.92 84.45,7.62 86.36,7.62 v87.63,6.35
PIN15  (via drill 1)
  Top 0.254: IC3.15 84.77,8.56 v85.09,8.89
PIN16  (via drill 1)
  Top 0.254: IC3.16 83.83,9.21 84.77,10.16 85.72,10.16 87,8.89 v87.63,8.89
PIN17  (via drill 1)
  Top 0.254: IC3.17 83.53,9.87 v85.09,11.43
PIN18  (via drill 1)
  Top 0.254: IC3.18 82.59,10.52 84.77,12.7 85.72,12.7 87,11.43 v87.63,11.43
PIN19  (via drill 1)
  Top 0.254: IC3.19 82.28,11.16 v85.09,13.97
PIN20  (via drill 1)
  Top 0.254: IC3.20 81.98,11.81 83.82,13.65 83.82,14.29 84.77,15.24 85.41,15.24 86.68,13.97 v87.63,13.97
PIN_GND  (via drill 1)  (14 unrouted)
  Top 0.813: v59.69,16.51 v97.79,16.51
  other vias: 62.23,16.51 64.77,16.51 67.31,16.51 69.85,16.51 72.39,16.51 74.93,16.51 77.47,16.51 80.01,16.51 82.55,16.51 85.09,16.51 87.63,16.51 90.17,16.51 92.71,16.51 95.25,16.51
PIN_VCC  (via drill 1)  (14 unrouted)
  Top 0.813: v59.69,1.27 v97.79,1.27
  other vias: 62.23,1.27 64.77,1.27 67.31,1.27 69.85,1.27 72.39,1.27 74.93,1.27 77.47,1.27 80.01,1.27 82.55,1.27 85.09,1.27 87.63,1.27 90.17,1.27 92.71,1.27 95.25,1.27
VBAT
  Top 0.2: J1.32 arc-76 25.6,16 arc57 26.7,15.4 29,15.4 arc-46 30.61,14.71 IC1.1

### Text on the board
tPlace: Rst | Sys
bPlace: PA0 | PA1 | PA2 | PA3 | PA4 | PA5 | PA6 | PA7 | Vbat | GND | AVCC | PA15 | PA14 | PA13 | PA12 | PA11 | PA10 | PA9 | PA8 | PB15 | L- | CAN | H+ | Rev.13A | CANARM | GND | i@tuxotronic.org | PB1 | PB2 | PB3 | PB4 | PB5 | PB6 | PB7 | !RST | +3V3 | GND | PC15 | PC14 | PB8 | PB9 | PB10 | PB11 | PB12 | PB13 | PB14 | PB0